# EAGLE design Power-Controller (EAGLE 9.6.2)
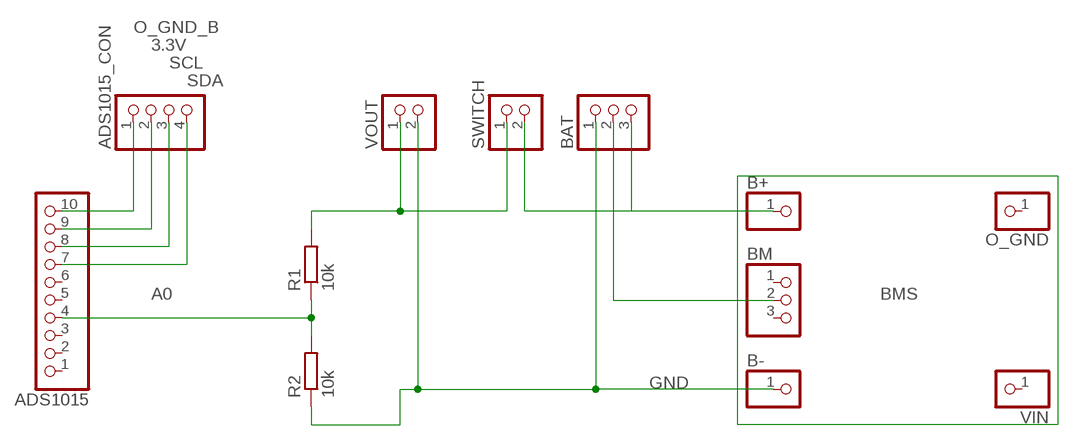
[diagram p0: schematic, sheet 1]

## Parts
ADS1015  PINHD-1X10  [1X10]
ADS1015_CON  PINHD-1X4/90  [1X04/90]
B+  PINHD-1X1  [1X01]
B-  PINHD-1X1  [1X01]
BAT  PINHD-1X3/90  [1X03/90]
BM  PINHD-1X3  [1X03]
O_GND  PINHD-1X1  [1X01]
R1  10k  R-EU_0204/7  [0204/7]
R2  10k  R-EU_0204/7  [0204/7]
SWITCH  PINHD-1X2  [1X02]
VIN  PINHD-1X1  [1X01]
VOUT  PINHD-1X2/90  [1X02/90]

## Nets
3.3V: ADS1015.9 ADS1015_CON.2
A0: ADS1015.4 R1.1 R2.2
GND: B-.1 BAT.1 R2.1 VOUT.2
N$1: B+.1 BAT.3 SWITCH.2
N$3: BAT.2 BM.2
N$4: R1.2 SWITCH.1 VOUT.1
O_GND_B: ADS1015.10 ADS1015_CON.1
SCL: ADS1015.8 ADS1015_CON.3
SDA: ADS1015.7 ADS1015_CON.4
Unconnected: ADS1015.1 ADS1015.2 ADS1015.3 ADS1015.5 ADS1015.6 BM.1 BM.3 O_GND.1 VIN.1

## Library data of the parts
ADS1015 = pinhead:PINHD-1X10: PIN HEADER
ADS1015_CON = pinhead:PINHD-1X4: PIN HEADER
B+ B- O_GND VIN = pinhead:PINHD-1X1: PIN HEADER
BAT BM = pinhead:PINHD-1X3: PIN HEADER
R1 R2 = rcl:R-EU_: RESISTOR, European symbol; SPICEPREFIX: R
SWITCH VOUT = pinhead:PINHD-1X2: PIN HEADER

## Board
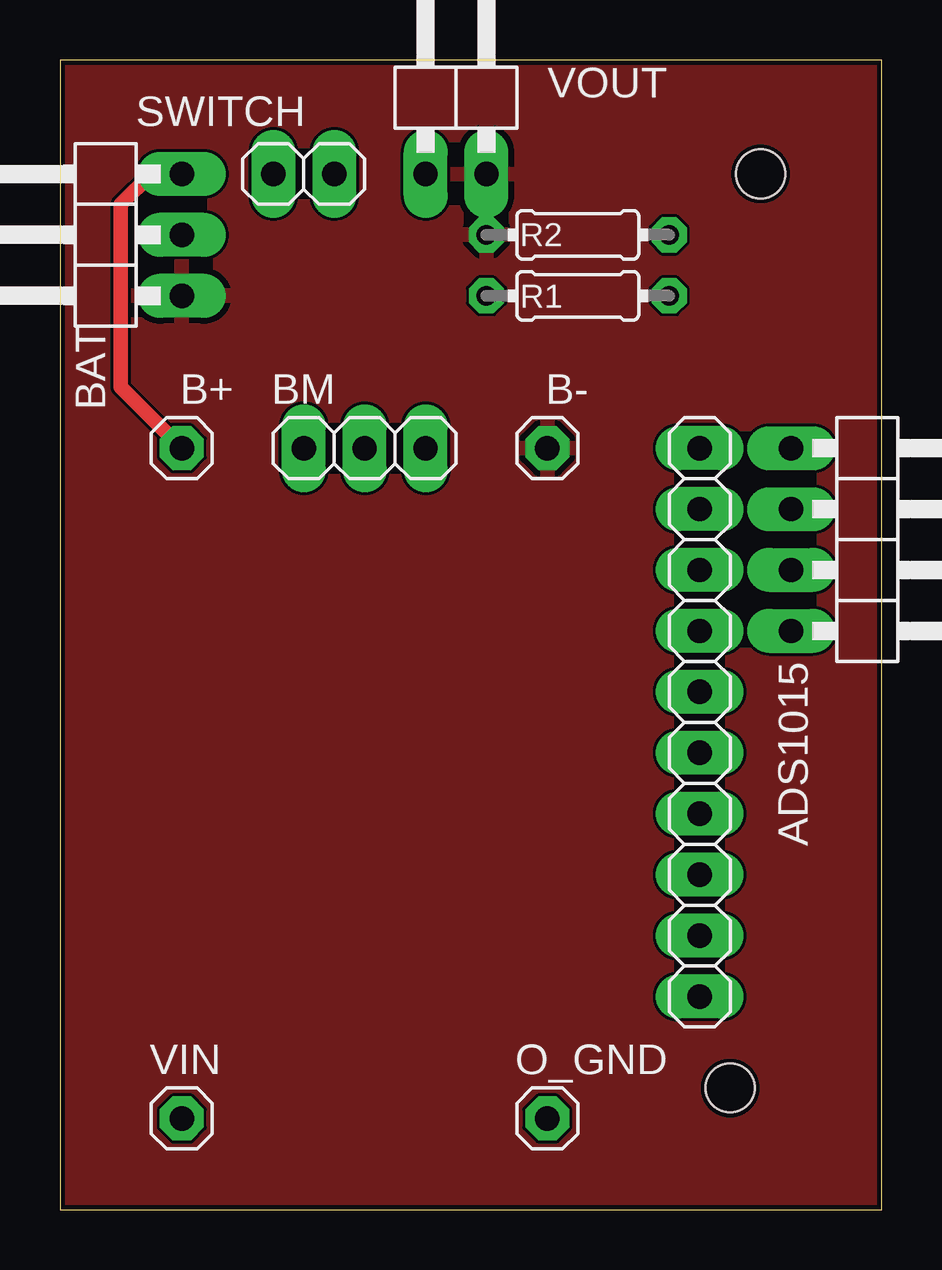
[diagram p1: board, top side]
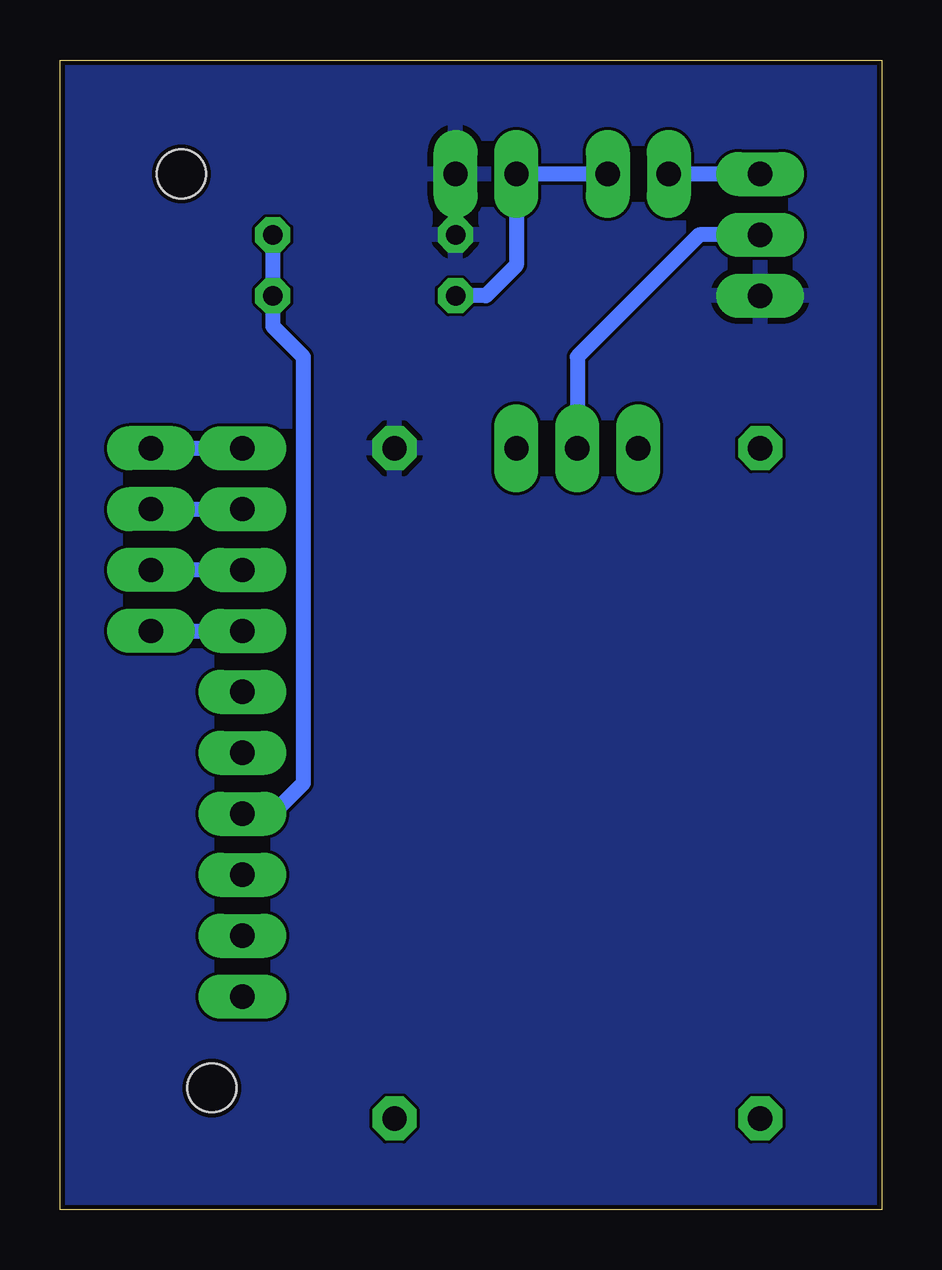
[diagram p2: board, bottom side, seen from below]

Size 34.27 x 47.93 mm. Coordinates in mm from the lower left corner, seen from the top.
Outline: 0,0 34.27,0 34.27,47.93 0,47.93 0,0
Copper layers (1*16): Top 0.035mm / dielectric 1.6mm / Bottom 0.035mm
Design rules "jlcpcb-2layers": minimum track width 5mil, minimum drill 0.3mm, track to track 5mil, track to pad 5mil, pad to pad 5mil, via to via 5mil, smd to smd 5mil, copper to edge 0.2mm, drill to drill 6mil, minimum pad ring 10mil, minimum via ring 3mil, stop-mask expansion 4mil, vias tented up to drill 0mil, thermal gap 10mil
Holes 2.03 mm at 29.21,43.18 27.94,5.08

### Footprints (pad centres in the part's own frame; a part is rotated, then mirrored left to right if it is on the bottom)
1X10 = drill 1.016 long: 1 -11.43,0; 2 -8.89,0; 3 -6.35,0; 4 -3.81,0; 5 -1.27,0; 6 1.27,0; 7 3.81,0; 8 6.35,0; 9 8.89,0; 10 11.43,0
1X04/90 = drill 1.016 long: 1 -3.81,-3.81; 2 -1.27,-3.81; 3 1.27,-3.81; 4 3.81,-3.81
1X01 = drill 1.016 octagon: 1 0,0
1X03/90 = drill 1.016 long: 1 -2.54,-3.81; 2 0,-3.81; 3 2.54,-3.81
1X03 = drill 1.016 long: 1 -2.54,0; 2 0,0; 3 2.54,0
0204/7 = drill 0.813 octagon: 1 -3.81,0; 2 3.81,0
1X02 = drill 1.016 long: 1 -1.27,0; 2 1.27,0
1X02/90 = drill 1.016 long: 1 -1.27,-3.81; 2 1.27,-3.81

### Placement (x,y rotation side)
ADS1015  26.67,20.32 90 top
ADS1015_CON  34.29,27.94 270 top
B+  5.08,31.75 0 top
B-  20.32,31.75 0 top
BAT  1.27,40.64 90 top
BM  12.7,31.75 0 top
O_GND  20.32,3.81 0 top
R1  21.59,38.1 180 top
R2  21.59,40.64 0 top
SWITCH  10.16,43.18 180 top
VIN  5.08,3.81 0 top
VOUT  16.51,46.99 0 top

### Tracks (layer width: path | path; a pad name or v marks a point on that pad's centre or on a via)
3.3V
  Bottom 0.635: ADS1015_CON.2 ADS1015.9
A0
  Bottom 0.635: R2.2 R1.1 25.4,36.83 24.13,35.56 24.13,17.78 25.4,16.51 ADS1015.4
GND
  pour Bottom: 0,48.26 34.29,48.26 34.29,0 0,0
  pour Top: 0,48.26 0,0 34.29,0 34.29,48.26
N$1
  Top 0.61: BAT.3 3.81,43.18 2.54,41.91 2.54,34.29 B+.1
  Bottom 0.635: BAT.3 SWITCH.2
N$3
  Bottom 0.635: BAT.2 7.62,40.64 12.7,35.56 BM.2
N$4
  Bottom 0.635: SWITCH.1 VOUT.1 15.24,39.37 16.51,38.1 R1.2
O_GND_B
  Bottom 0.635: ADS1015_CON.1 ADS1015.10
SCL
  Bottom 0.635: ADS1015.8 ADS1015_CON.3
SDA
  Bottom 0.635: ADS1015_CON.4 ADS1015.7